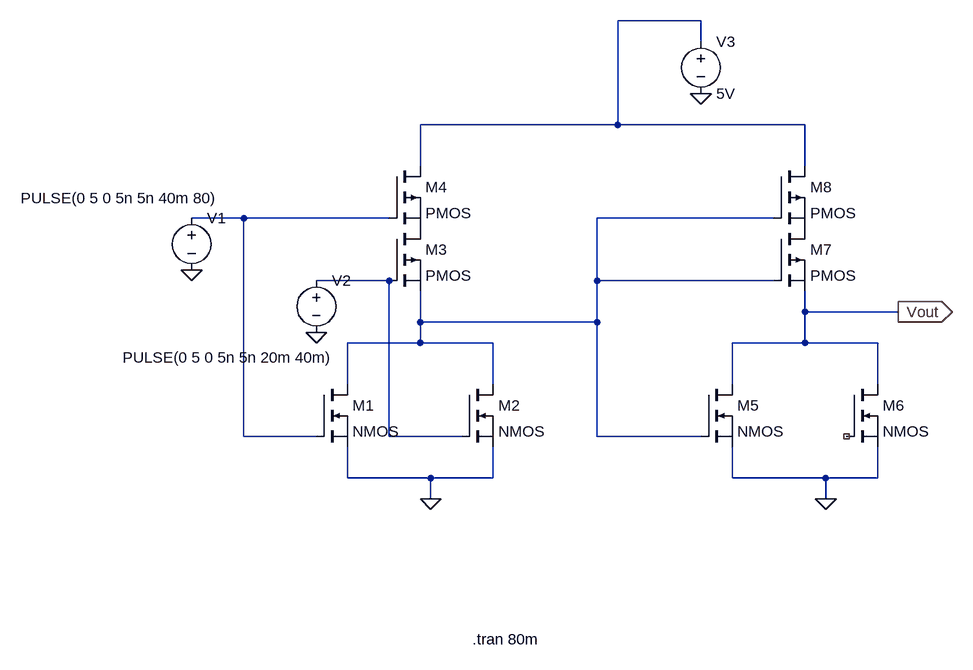
[diagram p0: schematic Cmos_OR.asc]
Cmos_OR.asc, the LTspice schematic file:
Version 4
SHEET 1 1264 680
WIRE 608 -368 480 -368
WIRE 608 -336 608 -368
WIRE 480 -208 480 -368
WIRE 480 -208 176 -208
WIRE 768 -208 480 -208
WIRE 176 -144 176 -208
WIRE 768 -144 768 -208
WIRE -96 -64 -176 -64
WIRE 128 -64 -96 -64
WIRE 720 -64 448 -64
WIRE 128 32 16 32
WIRE 448 32 448 -64
WIRE 720 32 448 32
WIRE 768 80 768 48
WIRE 912 80 768 80
WIRE 176 96 176 48
WIRE 448 96 448 32
WIRE 448 96 176 96
WIRE 176 128 176 96
WIRE 176 128 64 128
WIRE 288 128 176 128
WIRE 768 128 768 80
WIRE 768 128 656 128
WIRE 880 128 768 128
WIRE 64 192 64 128
WIRE 288 192 288 128
WIRE 656 192 656 128
WIRE 880 192 880 128
WIRE -96 272 -96 -64
WIRE 16 272 -96 272
WIRE 128 272 128 32
WIRE 240 272 128 272
WIRE 448 272 448 96
WIRE 608 272 448 272
WIRE 64 336 64 288
WIRE 192 336 64 336
WIRE 288 336 288 288
WIRE 288 336 192 336
WIRE 656 336 656 288
WIRE 800 336 656 336
WIRE 880 336 880 288
WIRE 880 336 800 336
WIRE 192 368 192 336
WIRE 800 368 800 336
FLAG 192 368 0
FLAG 800 368 0
FLAG -176 16 0
FLAG 16 112 0
FLAG 608 -256 0
FLAG 912 80 Vout
IOPIN 912 80 Out
SYMBOL nmos 16 192 R0
SYMATTR InstName M1
SYMBOL nmos 240 192 R0
SYMATTR InstName M2
SYMBOL pmos 128 -48 R0
SYMATTR InstName M3
SYMBOL pmos 128 -144 R0
SYMATTR InstName M4
SYMBOL nmos 608 192 R0
SYMATTR InstName M5
SYMBOL nmos 832 192 R0
SYMATTR InstName M6
SYMBOL pmos 720 -48 R0
SYMATTR InstName M7
SYMBOL pmos 720 -144 R0
SYMATTR InstName M8
SYMBOL voltage -176 -80 R0
WINDOW 3 -263 -15 Left 2
WINDOW 123 0 0 Left 0
WINDOW 39 0 0 Left 0
SYMATTR InstName V1
SYMATTR Value PULSE(0 5 0 5n 5n 40m 80)
SYMBOL voltage 16 16 R0
WINDOW 3 -298 134 Left 2
WINDOW 123 0 0 Left 0
WINDOW 39 0 0 Left 0
SYMATTR InstName V2
SYMATTR Value PULSE(0 5 0 5n 5n 20m 40m)
SYMBOL voltage 608 -352 R0
WINDOW 123 0 0 Left 0
WINDOW 39 0 0 Left 0
SYMATTR InstName V3
SYMATTR Value 5V
TEXT 256 584 Left 2 !.tran 80m

The netlist it stands for:
* Cmos_OR.asc
M1 N003 N002 0 0 NMOS
M2 N003 N004 0 0 NMOS
M3 P001 N004 N003 N003 PMOS
M4 N001 N002 P001 P001 PMOS
M5 Vout N003 0 0 NMOS
M6 Vout NC_01 0 0 NMOS
M7 P002 N003 Vout Vout PMOS
M8 N001 N003 P002 P002 PMOS
V1 N002 0 PULSE(0 5 0 5n 5n 40m 80)
V2 N004 0 PULSE(0 5 0 5n 5n 20m 40m)
V3 N001 0 5V
.model NMOS NMOS
.model PMOS PMOS
.lib standard.mos
.tran 80m
.backanno
.end